# EAGLE design tgs2611-c00 (EAGLE 9.6.2)
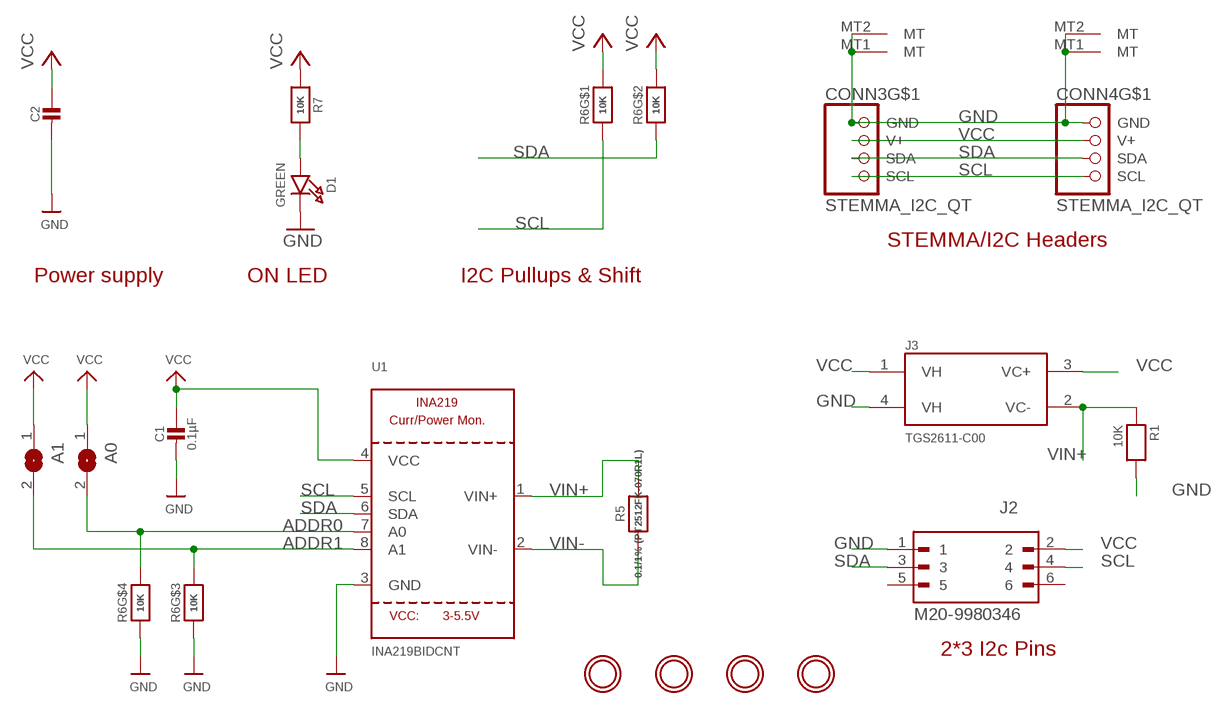
[diagram p0: schematic, sheet 1]

## Parts
A0  SOLDERJUMPERREFLOW_NOPASTE  [SOLDERJUMPER_REFLOW_NOPASTE]
A1  SOLDERJUMPERREFLOW_NOPASTE  [SOLDERJUMPER_REFLOW_NOPASTE]
C1  0.1µF  CAP_CERAMIC0603  [0603]
C2  10uF  CAP_CERAMIC_0805MP  [_0805MP]
CONN3  STEMMA_I2C_QT  [JST_SH4]
CONN4  STEMMA_I2C_QT  [JST_SH4]
D1  GREEN  LED0603_NOOUTLINE  [CHIPLED_0603_NOOUTLINE]
J2  M20-9980346  [HARWIN_M20-9980346]
J3  TGS2611-C00  [TO180P920X780-4P]
R1  10K  RESISTOR0603  [0603]
R5  0.1/1% (PT2512FK-070R1L)  RESISTOR2512  [2512]
R6  10K  RESISTOR_4PACK  [RESPACK_4X0603]
R7  10K  RESISTOR_0603MP  [_0603MP]
U1  INA219BIDCNT  INA219  [SOT23-8]
U$1  MOUNTINGHOLE2.5  [MOUNTINGHOLE_2.5_PLATED]
U$6  MOUNTINGHOLE2.5  [MOUNTINGHOLE_2.5_PLATED]
U$7  MOUNTINGHOLE2.5  [MOUNTINGHOLE_2.5_PLATED]
U$8  MOUNTINGHOLE2.5  [MOUNTINGHOLE_2.5_PLATED]

## Nets
ADDR0: A0.2 R6.5 U1.7(A0)
ADDR1: A1.2 R6.6 U1.8(A1)
GND: C1.2 C2.2 CONN3.1(GND) CONN3.MT1(MT) CONN3.MT2(MT) CONN4.1(GND) CONN4.MT1(MT) CONN4.MT2(MT) D1.C J2.1 J3.4(VH) R1.2 R6.3 R6.4 U1.3(GND)
N$3: D1.A R7.2
SCL: CONN3.4(SCL) CONN4.4(SCL) J2.4 R6.1 U1.5(SCL)
SDA: CONN3.3(SDA) CONN4.3(SDA) J2.3 R6.2 U1.6(SDA)
VCC: A0.1 A1.1 C1.1 C2.1 CONN3.2(V+) CONN4.2(V+) J2.2 J3.1(VH) J3.3(VC+) R6.7 R6.8 R7.1 U1.4(VCC)
VIN+: J3.2(VC-) R1.1 R5.2 U1.1(VIN+)
VIN-: R5.1 U1.2(VIN-)
Unconnected: J2.5 J2.6

## Notes on the sheet
- STEMMA/I2C Headers
- Power supply | ON LED | I2C Pullups & Shift
- 2*3 I2c Pins

## Library data of the parts
A0 A1 = microbuilder:SOLDERJUMPER: SMD Solder JUMPER Solder the two pads together to create a connection, or remove the solder to break it. REFLOW - Use this footprint for solder paste and reflow ovens. WAVE - Use this footprint for hand-soldering (larger pads). CLOSED - Has a trace between the two pads to ensure it is closed by default. The trace needs to be cut to disable the jumper, and can be closed again by creating a solder bridge between the two pads.
C1 C2 = microbuilder:CAP_CERAMIC: Ceramic Capacitors 0402 - 0402 Surface Mount Capacitors 16pF 50V 5% [Digikey: 445-4899-2-ND] 18pF 50V 5% [Digikey: 490-1281-2-ND] 22pF 50V 5% [Digikey: 490-1283-2-ND] 68pF 50V 5% [Digikey: 490-1289-2-ND] 0.1uF 10V 10% [Digikey: 490-1318-2-ND] 1.0uF 6.3V 10% [Digikey: 490-1320-2-ND] 0603 - 0603 Surface Mount Capacitors 16 pF 50V 5% [Digikey: 445-5051-2-ND] 22 pF 50V [Digikey: PCC220ACVTR-ND] 33 pF 50V 5% [Digikey: 490-1415-1-ND] 56pF 50V 5% [Digikey: 490-1421-1-ND] 220pF 50V 5% [Digikey: 445-1285-1-ND] 680 pF 50V 2200 pF 50V 5% C0G [Digikey: 445-1297-1-ND] 5600 pF 100V 5% X7R [Digikey: 478-3711-1-ND] 0.1 µF 25V 10% [Digikey: PCC2277TR-ND] 0.22 µF 16V 10% X7R [Digikey: 445-1318-1-ND] 1.0 µF 25V 10% [Digikey: 445-5146-2-ND] 0603 - RF Specific 3pF 250V +/-0.1pF RF [Digikey: 712-1347-1-ND] 18 pF 250V 5% [Digikey: 478-3505-1-ND or 712-1322-1-ND] 56 pF 250V 5% C0G RF [Digikey: 490-4867-1-ND] 68 pF 250V RF [Digikey: 490-4868-1-ND] 0805 - 0805 Surface Mount Capacitors 220 pF 250V 2% RF Ceramic Capacitor [Digikey: 712-1398-1-ND] 1000 pF 50V 2% NP0 Ceramic Capacitor [Digikey: 478-3760-1-ND] 0.1 µF 25V 10% Ceramic Capacitor [Digikey: PCC1828TR-ND] 1.0 µF 16V 10% Ceramic Capacitor[Digikey: 490-1691-2-ND] 10.0 µF 10V 10% Ceramic Capacitor[Digikey: 709-1228-1-ND] 10.0 uF 16V 10% Ceramic Capacitor [Digikey: 478-5165-2-ND] 47 uF 6.3V 20% Ceramic Capacitor [Digikey: 587-1779-1-ND or 399-5506-1-ND] 1206 - 1206 Surface Mount Capacitors 47uF 10V 20% Ceramic Capacitor [Digikey: 490-5528-1-ND or 399-5508-1-ND or 445-6010-1-ND] 100uF 6.3V -20%, +80% Y5V Ceramic Capacitor (Digikey: 490-4512-1-ND, Mouser: 81-GRM31CF50J107ZE1L)
CONN3 CONN4 = microbuilder:STEMMA_I2C
D1 = microbuilder:LED: LED 0603 - 0603 Surface Mount Package 2mA: Green LED - Low Power (3.9mcd, 2ma, 1.7Vf) - Digikey: 475-2709-2-ND Orange LED - Low Power (9.8mcd, 2ma, 1.8Vf) - Digikey: 475-1194-2-ND Red LED - Low Power (5mcd, 2ma, 1.8Vf) - Digikey: 475-1195-2-ND Yellow LED - Low Power (7mcd, 2ma, 1.8Vf) - Digikey: 475-1196-2-ND 5mA: Blue LED - Low Power (17mcd, 5ma, 2.9Vf) - Digikey: LNJ937W8CRACT-ND 0805 - 0805 Surface Mount Package 2mA: Red LED (8.8mcd, 2mA, 1.8Vf, Clear) - Low Power [Digikey: 475-2510-1-ND] Green LED (5mcd, 2mA, 1.8Vf, Clear) - Low Power [Digikey: 475-2730-1-ND] Yellow LED (11.3mcd, 2mA, 1.8Vf, Clear) - Low Power [Digikey: 475-2555-1-ND] 20mA: Red LED (104mcd, 20mA, Diffused) - LS R976 [Digikey: 475-1278-6-ND] Red LED (12mcd, 20mA, 2.0Vf, Clear) - APT2012EC [Digikey: 754-1128-1-ND] Green LED (15mcd, 20mA, 2.2Vf, Clear) - APT2012GC [Digikey: 754-1131-1-ND] Orange LED (160mcd, 20mA, 2.1Vf, Clear) - APT2012SECK [Digikey: 754-1130-1-ND] 1206 - 1206 Surface Mount Package Green LED (26mcd, 20mA, Diffused) - LG N971 [Digikey: 475-1407-6-ND] Red LED (15mcd, 20mA, Diffused) - LH N974 [Digikey: 475-1416-6-ND] Cree - Cree High-Power Surface Mount LEDs XPEBWT-L1-0000-00D50 - White 111lm 350mA 2.9Vf 6200K 110° XTEAWT-00-0000-00000LEE3 - White 114lm 350mA 2.85Vf 5000K 115° Everlight - Everlight 45-21 Series Surface Mount LEDs 45-21/QK2C-B2832AC2CB2/2T - Warm White 2000mcd 20mA 3.25Vf 3050K 120° 45-21/LK2C-B38452C4CB2/2T - Nuetral White 2000mcd 20mA 3.25Vf 4150K 120° 45-21/LK2C-B50634C6CB2/2T - Cold White 2200mcd 20mA 3.25Vf 5650K 120° PLCC2 Reverse Mount LS T77K-J1L2-1-0-2-R18-Z - Red 11.25mcd 2mA 1.8Vf 630nm 120° LO T77K-L1M2-24-Z - Orange 19.6mcd 2mA 1.8Vf 606nm 120° LY T77K-K2M1-26-Z - Yellow 15.7mcd 2mA 1.8Vf 587nm 120°
J2 = M20-9980346:M20-9980346; MANUFACTURER: HARWIN; STANDARD: Manufacturer Recommendations
J3 = TGS2611-C00:TGS2611-C00: Methane, Natural Gas sensor, Check availability <https://pricing.snapeda.com/parts/TGS2611-C00/Figaro/view-part?ref=eda>; AVAILABILITY: Not in stock; CHECK_PRICES: https://www.snapeda.com/parts/TGS2611-C00/Figaro/view-part/?ref=eda; DESCRIPTION: Gas Sensor 4-Pin TO-5; MF: Figaro; MP: TGS2611-C00; PACKAGE: None; PRICE: None; SNAPEDA_LINK: https://www.snapeda.com/parts/TGS2611-C00/Figaro/view-part/?ref=snap
R1 R5 R7 = microbuilder:RESISTOR: Resistors 0402 - 0402 Surface Mount Package 22 Ohm 1% 1/16W [Digikey: 311-22.0LRTR-ND] 33 Ohm 5% 1/16W 1.0K 5% 1/16W 1.5K 5% 1/16W 2.0K 1% 1/16W 10.0K 1% 1/16W [Digikey: 311-10.0KLRTR-ND] 10.0K 5% 1/16W [Digikey: RMCF0402JT10K0TR-ND] 12.1K 1% 1/16W [Digikey: 311-22.0LRTR-ND] 100.0K 5% 1/16W 0603 - 0603 Surface Mount Package 0 Ohm 1/10 Watt 1% Resistor 15 Ohm 1/10 Watt 1% Resistor 33 Ohm 1/10 Watt 1% Resistor 49.9 Ohm 1/10 Watt 1% Resistor 100 Ohm 1/10 Watt 1% Resistor 150 Ohm 1/10 Watt 1% Resistor 240 Ohm 1/10 Watt 1% Resistor 390 Ohm 1/10 Watt 1% Resistor 560 Ohm 1/10 Watt 1% Resistor 680 Ohm 1/10 Watt 1% Resistor 750 Ohm 1/10 Watt 1% Resistor 1.0K Ohm 1/10 Watt 1% Resistor 1.5K Ohm 1/10 Watt 1% Resistor 2.0K Ohm 1/10 Watt 1% Resistor 2.2K Ohm 1/10 Watt 1% Resistor 3.3K Ohm 1/10 Watt 1% Resistor 4.7K Ohm 1/10 Watt 1% Resistor 10.0K Ohm 1/10 Watt 1% Resistor 12.0K Ohm 1/10 Watt 1% Resistor 12.1K Ohm 1/10 Watt 1% Resistor 20.0K Ohm 1/10 Watt 1% Resistor 33.0K Ohm 1/10 Watt 1% Resistor 100.0K Ohm 1/10 Watt 1% Resistor 0805 - 0805 Surface Mount Package 0 Ohm 1/8 Watt 1% Resistor 33 Ohm 1/8 Watt 1% Resistor 100 Ohm 1/8 Watt 1% Resistor 150 Ohm 1/8 Watt 1% Resistor 200 Ohm 1/8 Watt 1% Resistor 240 Ohm 1/8 Watt 1% Resistor 330 Ohm 1/8 Watt 1% Resistor 390 Ohm 1/8 Watt 1% Resistor 470 Ohm 1/8 Watt 1% Resistor 1.0K Ohm 1/8 Watt 1% Resistor 1.5K Ohm 1/8 Watt 1% Resistor 2.0K Ohm 1/8 Watt 1% Resistor 4.7K Ohm 1/8 Watt 1% Resistor 5.1K Ohm 1/8 Watt 1% Resistor 5.6K Ohm 1/8 Watt 1% Resistor 10.0K Ohm 1/8 Watt 1% Resistor 22.0K Ohm 1/8 Watt 1% Resistor 33.0K Ohm 1/8 Watt 1% Resistor 100K Ohm 1/8 Watt 1% Resistor 1206 - 1206 Surface Mount Package 2012 - 2010 Surface Mount Package 0.11 Ohm 1/2 Watt 1% Resistor - Digikey: RHM.11UCT-ND
R6 = microbuilder:RESISTOR_4PACK: Resistor Packs (4 resistors) 4 x 0603 10K 1/16W - Digikey: YC164J-10KCT-ND
U1 = microbuilder:INA219: INA219 - I2C Current/Power Monitor Voltage Range: 0-26V Accuracy: 0.5% Temperature: -40°C - 125°C
U$1 U$6-U$8 = microbuilder:MOUNTINGHOLE: Mounting Hole For #2 screws (0.086"/2.18mm width, 0.094"/2.4mm hole) use 2.5mm

## Net classes
1 highpower: width 0.305 mm, drill 0.483 mm
2 lowpower: width 0.254 mm, drill 0.483 mm

## Board
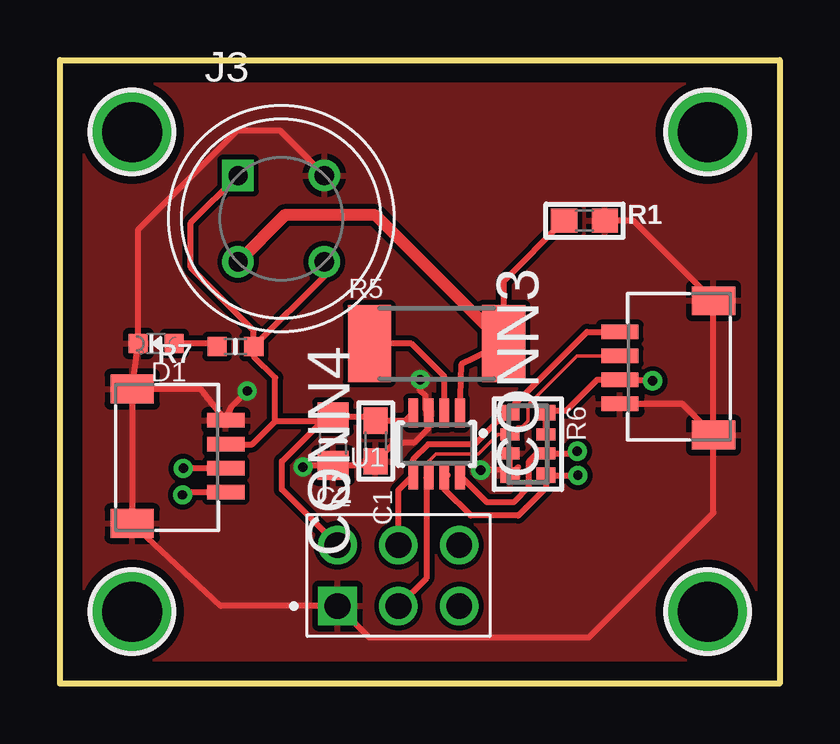
[diagram p1: board, top side]
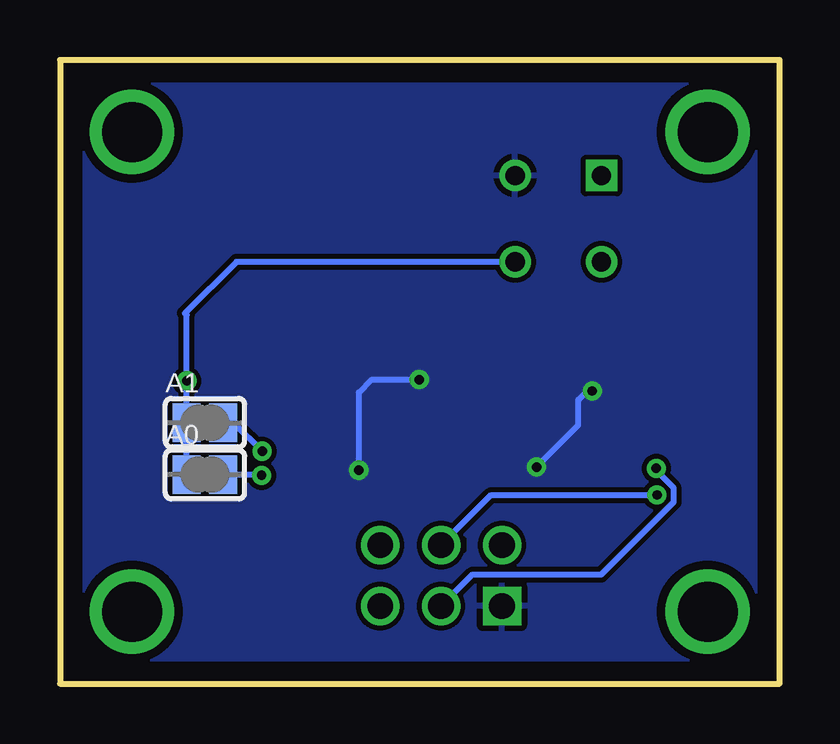
[diagram p2: board, bottom side, seen from below]

Size 30 x 26 mm. Coordinates in mm from the lower left corner, seen from the top.
Outline: 0,26 30,26 30,0 0,0 0,26
Copper layers (1*16): Top 0.035mm / dielectric 1.5mm / Bottom 0.035mm
Design rules "adafruit 7-7": minimum track width 6mil, minimum drill 15.5mil, track to track 8mil, track to pad 7mil, pad to pad 7mil, via to via 7mil, smd to smd 7mil, copper to edge 10mil, drill to drill 8mil, minimum pad ring 10mil, minimum via ring 8mil, stop-mask expansion 2mil, vias tented up to drill 20mil, thermal gap 10mil
bRestrict: area 13.2,5.5 to 13.3,6

### Footprints (pad centres in the part's own frame; a part is rotated, then mirrored left to right if it is on the bottom)
SOLDERJUMPER_REFLOW_NOPASTE = smd 1.168 x 1.6: 1 -0.762,0; 2 0.762,0
0603 = smd 1.1 x 1: 1 -0.85,0; 2 0.85,0
_0805MP = smd 1.2 x 1.3: 1 -1.016,0; 2 1.016,0
JST_SH4 = smd 0.6 x 1.55: 1 -1.5,2.514; 2 -0.5,2.514; 3 0.5,2.514; 4 1.5,2.514 | smd 1.2 x 1.8: MT1 -2.8,-1.386; MT2 2.8,-1.386
CHIPLED_0603_NOOUTLINE = smd 0.8 x 0.8: A 0,-0.75; C 0,0.75
HARWIN_M20-9980346 = drill 1.07 square: 1 -2.54,-1.27 | drill 1.07: 2 -2.54,1.27; 3 0,-1.27; 4 0,1.27; 5 2.54,-1.27; 6 2.54,1.27
TO180P920X780-4P = drill 0.8 square: 1 -1.8,1.8 | drill 0.8: 2 -1.8,-1.8; 3 1.8,-1.8; 4 1.8,1.8
2512 = smd 1.8 x 3.2: 1 -2.8,0; 2 2.8,0
RESPACK_4X0603 = smd 0.65 x 0.8: 1 -1.3,-0.75; 4 1.3,-0.75; 5 1.3,0.75; 8 -1.3,0.75 | smd 0.5 x 0.8: 2 -0.4,-0.75; 3 0.4,-0.75; 6 0.4,0.75; 7 -0.4,0.75
_0603MP = smd 0.8 x 0.8: 1 -0.762,0; 2 0.762,0
SOT23-8 = smd 0.4 x 1.2: 1 -0.975,-1.3; 2 -0.325,-1.3; 3 0.325,-1.3; 4 0.975,-1.3; 5 0.975,1.3; 6 0.325,1.3; 7 -0.325,1.3; 8 -0.975,1.3
MOUNTINGHOLE_2.5_PLATED = drill 2.5 pad 3.2: P$1 0,0

### Placement (x,y rotation side)
A0  23.95,8.71 0 bottom
A1  23.95,10.87 0 bottom
C1  13.16,10.11 270 top
C2  11.38,10.11 270 top
CONN3  25.86,13.16 90 top
CONN4  4.4,9.48 270 top
D1  4.02,14.18 90 top
J2  14.11,4.5 0 top
J3  9.22,19.38 0 top
R1  21.87,19.29 0 top
R5  15.7,14.18 0 top
R6  19.51,9.98 270 top
R7  7.32,14.05 180 top
U1  15.7,9.98 180 top
U$1  3,3 0 top
U$6  27,3 0 top
U$7  3,23 0 top
U$8  27,23 0 top

### Tracks (layer width: path | path; a pad name or v marks a point on that pad's centre or on a via)
ADDR0  (via drill 0.39)
  Top 0.254: v21.59,8.68 R6.5 20.26,8.16 19.11,7 17.13,7 16.02,8.1 U1.7 16.17,8.68
  Bottom 0.254: A0.2 21.62,8.71 v21.59,8.68
ADDR1  (via drill 0.39)
  Top 0.254: v21.57,9.69 21.46,9.59 R6.6 19.88,9.59 19.55,9.26 19.55,8.21 18.92,7.57 17.79,7.57 U1.8
  Bottom 0.254: A1.2 22.75,10.87 v21.57,9.69
GND  (via drill 0.39)
  Top 0.254: 18.79,8.65 R6.4 | CONN4.MT1 D1.C 3.27,18.93 7.4,23.06 9.15,23.06 11.02,21.19 J3.4 | R1.2 23.91,19.29 CONN3.MT2 CONN3.MT1 | CONN3.MT1 27.25,7.12 22.05,1.93 18.09,1.93 18.08,1.92 12.89,1.92 J2.1 6.71,3.23 CONN4.MT2 CONN4.MT1 | CONN3.MT1 25.95,11.66 CONN3.1 | v10.13,9.03 10.2,9.1 C2.2 12.99,9.1 C1.2 13.96,10.06 14.78,10.06 15.35,10.63 15.35,11.31 | v7.81,12.2 7.17,11.56 CONN4.1 5.87,12.28 CONN4.MT1 | U1.3 15.35,11.31 | 15.35,11.31 15.23,11.43 15.23,12.01 15.02,12.22 v15.02,12.68 | R6.4 R6.3 | R6.4 18.55,8.9 v17.54,8.9 | R6.4 19.1,9.02
  Bottom 0.254: v10.13,9.03 8.39,10.77 8.39,11.83 8.02,12.2 v7.81,12.2 | v17.54,8.9 17.54,12.14 17.01,12.68 v15.02,12.68
  pour Top (isolate 0.15): 1,25 29,25 29,1 1,1
  pour Bottom (isolate 0.1): 1,25 29,25 29,1 1,1
N$3
  Top 0.254: R7.2 6.43,14.18 D1.A
SCL  (via drill 0.39)
  Top 0.254: J2.4 14.11,8.07 U1.5 14.72,9.34 15.36,9.98 17.27,9.98 18.23,10.94 18.41,10.94 R6.1 18.76,11.45 21.97,14.66 CONN3.4 | CONN4.4 5.23,7.98 v5.11,7.86
  Bottom 0.254: J2.4 12.02,7.86 v5.11,7.86
SDA  (via drill 0.39)
  Top 0.152: CONN3.3 21.55,13.66 19.5,11.61 19.5,10.94 19.27,10.71 19.08,10.71 R6.2 18.25,10.38 17.44,9.57 15.67,9.57 15.38,9.28 U1.6
  Top 0.254: J2.3 15.27,4.39 15.27,8.58 U1.6 | CONN4.3 7.16,8.97 v5.14,8.97
  Bottom 0.254: J2.3 12.8,4.55 7.43,4.55 4.41,7.57 4.41,8.16 5.14,8.89 v5.14,8.97
VCC  (via drill 0.39)
  Top 0.254: CONN4.2 8.02,9.98 8.97,10.93 | 8.97,10.93 8.97,12.75 8.08,13.64 R7.1 | 10.92,10.93 11.18,10.93 C2.1 12.99,11.13 C1.1 14.4,10.96 U1.4 | 10.92,10.93 8.97,10.93 | R7.1 11.02,16.99 J3.3 | J2.2 9.26,8.09 9.26,9.27 10.92,10.93 | R7.1 8.08,14.73 5.46,17.35 5.46,19.22 J3.1 | v24.71,12.62 24.67,12.66 CONN3.2 22.39,12.66 21.11,11.38 20.35,11.38 R6.8 R6.7
  Bottom 0.254: 24.78,15.44 24.71,15.37 v24.71,12.62 A1.1 A0.1 | 24.78,15.44 | 24.78,15.44 22.64,17.58 J3.3
VIN+
  Top 0.254: R1.1 18.5,16.77 R5.2 16.74,13.31 U1.1
  Top 0.508: R5.2 13.15,19.52 9.36,19.52 J3.2
VIN-
  Top 0.254: U1.2 16.02,12.8 14.65,14.18 R5.1